# EAGLE schematic EnvLfo (EAGLE 6.5.0)
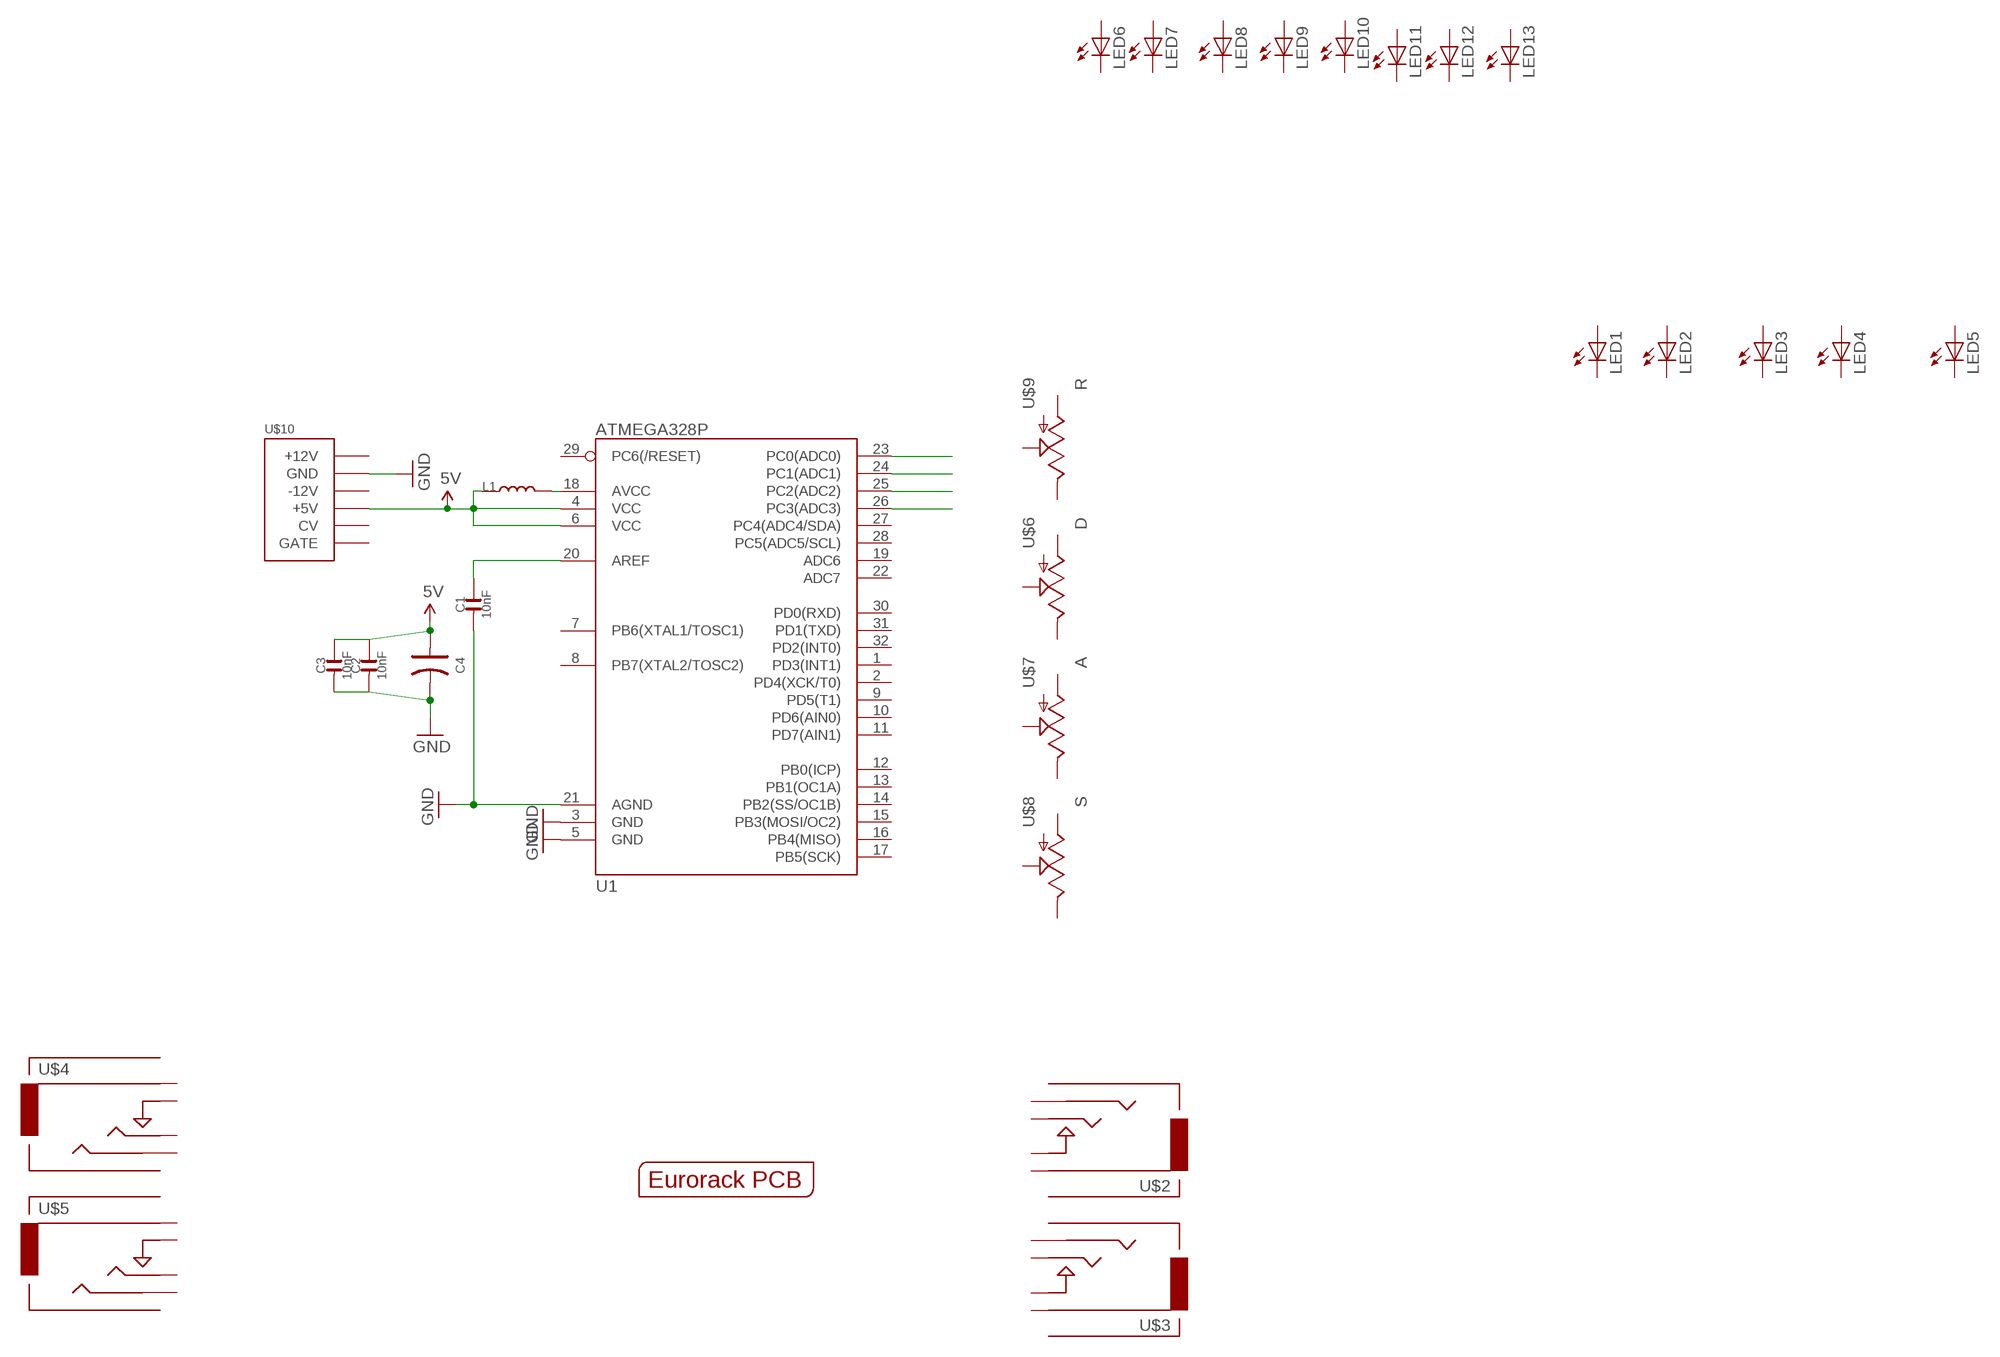
[diagram p0: schematic, sheet 1]

## Parts
C1  10nF  C-0603  [C0603]
C2  10nF  C-0603  [C0603]
C3  10nF  C-0603  [C0603]
C4  C-POLAR-A  [AVX-A]
L1  L-SPD3D16-4R7M  [L0420]
LED1  LED3MM  [LED3MM]
LED2  LED3MM  [LED3MM]
LED3  LED3MM  [LED3MM]
LED4  LED3MM  [LED3MM]
LED5  LED3MM  [LED3MM]
LED6  LED3MM  [LED3MM]
LED7  LED3MM  [LED3MM]
LED8  LED3MM  [LED3MM]
LED9  LED3MM  [LED3MM]
LED10  LED3MM  [LED3MM]
LED11  LED3MM  [LED3MM]
LED12  LED3MM  [LED3MM]
LED13  LED3MM  [LED3MM]
U1  ATMEGA328P  ATMEGA328_SMT  [TQFP32-08]
U$1  EURORACK_PCB8HP  [EURORACK8HPPCB]
U$2  Positive  AUDIO-JACKOUTPUT  [3.5MM-JACK-SWITCH-13MM-OUTPUT]
U$3  Negative  AUDIO-JACKOUTPUT  [3.5MM-JACK-SWITCH-13MM-OUTPUT]
U$4  Retrigger  AUDIO-JACKINPUT  [3.5MM-JACK-SWITCH-13MM-INPUT]
U$5  Gate  AUDIO-JACKINPUT  [3.5MM-JACK-SWITCH-13MM-INPUT]
U$6  D  POTZEPHPOT  [OG-POTS_ALPS_POT_VERTICAL]
U$7  A  POTZEPHPOT  [OG-POTS_ALPS_POT_VERTICAL]
U$8  S  POTZEPHPOT  [OG-POTS_ALPS_POT_VERTICAL]
U$9  R  POTZEPHPOT  [OG-POTS_ALPS_POT_VERTICAL]
U$10  POWER  [POWER_16]

## Nets
5V: C2.2 C3.2 C4.+ L1.1 U1.4(VCC) U1.6(VCC) U$10.11(+5V) U$10.12(+5V)
GND: C1.1 C2.1 C3.1 C4.- U1.3(GND) U1.5(GND) U1.21(AGND) U$10.3(GND) U$10.4(GND) U$10.5(GND) U$10.6(GND) U$10.7(GND) U$10.8(GND)
N$1: C1.2 U1.20(AREF)
N$3: L1.2 U1.18(AVCC)
N$6: U1.23(PC0(ADC0))
N$7: U1.24(PC1(ADC1))
N$8: U1.25(PC2(ADC2))
N$9: U1.26(PC3(ADC3))
Unconnected: LED1.A LED1.K(C) LED2.A LED2.K(C) LED3.A LED3.K(C) LED4.A LED4.K(C) LED5.A LED5.K(C) LED6.A LED6.K(C) LED7.A LED7.K(C) LED8.A LED8.K(C) LED9.A LED9.K(C) LED10.A LED10.K(C) LED11.A LED11.K(C) LED12.A LED12.K(C) LED13.A LED13.K(C) U1.1(PD3(INT1)) U1.2(PD4(XCK/T0)) U1.7(PB6(XTAL1/TOSC1)) U1.8(PB7(XTAL2/TOSC2)) U1.9(PD5(T1)) U1.10(PD6(AIN0)) U1.11(PD7(AIN1)) U1.12(PB0(ICP)) U1.13(PB1(OC1A)) U1.14(PB2(SS/OC1B)) U1.15(PB3(MOSI/OC2)) U1.16(PB4(MISO)) U1.17(PB5(SCK)) U1.19(ADC6) U1.22(ADC7) U1.27(PC4(ADC4/SDA)) U1.28(PC5(ADC5/SCL)) U1.29(PC6(/RESET)) U1.30(PD0(RXD)) U1.31(PD1(TXD)) U1.32(PD2(INT0)) U$2.RING@1(RING) U$2.RING@2(RING) U$2.SECOND@1(SECOND) U$2.SECOND@2(SECOND) U$2.SWITCH@1(SWITCH) U$2.SWITCH@2(SWITCH) U$2.TIP@1(TIP) U$2.TIP@2(TIP) U$3.RING@1(RING) U$3.RING@2(RING) U$3.SECOND@1(SECOND) U$3.SECOND@2(SECOND) U$3.SWITCH@1(SWITCH) U$3.SWITCH@2(SWITCH) U$3.TIP@1(TIP) U$3.TIP@2(TIP) U$4.RING@1(RING) U$4.RING@2(RING) U$4.SECOND@1(SECOND) U$4.SECOND@2(SECOND) U$4.SWITCH@1(SWITCH) U$4.SWITCH@2(SWITCH) U$4.TIP@1(TIP) U$4.TIP@2(TIP) U$5.RING@1(RING) U$5.RING@2(RING) U$5.SECOND@1(SECOND) U$5.SECOND@2(SECOND) U$5.SWITCH@1(SWITCH) U$5.SWITCH@2(SWITCH) U$5.TIP@1(TIP) U$5.TIP@2(TIP) U$6.P$1(E) U$6.P$2(S) U$6.P$3(A) U$7.P$1(E) U$7.P$2(S) U$7.P$3(A) U$8.P$1(E) U$8.P$2(S) U$8.P$3(A) U$9.P$1(E) U$9.P$2(S) U$9.P$3(A) U$10.1(-12V) U$10.2(-12V) U$10.9(+12V) U$10.10(+12V) U$10.13(CV) U$10.14(CV) U$10.15(GATE) U$10.16(GATE)

## Library data of the parts
C1-C3 = OPL:C*
C4 = OPL:C-POLAR*
L1 = OPL:L*
LED1-LED13 = SparkFun-LED:LED: LEDs Standard schematic elements and footprints for 5mm, 3mm, 1206, and 0603 sized LEDs. 5mm - Spark Fun Electronics SKU : COM-00529 (and others)
U1 = SparkFun-DigitalIC:ATMEGA328_SMT: 32-Pin Atmega328 part Commonly used on Arduino compatible boards Available in QFP and QFN packages TQFP is IC-09069 QFN is non-stock; PROD_ID: IC-09069
U$1 = EurorackModularParts:EURORACK_PCB
U$2-U$5 = EurorackModularParts:AUDIO-JACK: Switching Mono 3.5mm Audio Jack from Erthenvar.
U$6-U$9 = EurorackModularParts:POT
U$10 = EurorackModularParts:POWER